# EAGLE design PSU (EAGLE 7.3.0)
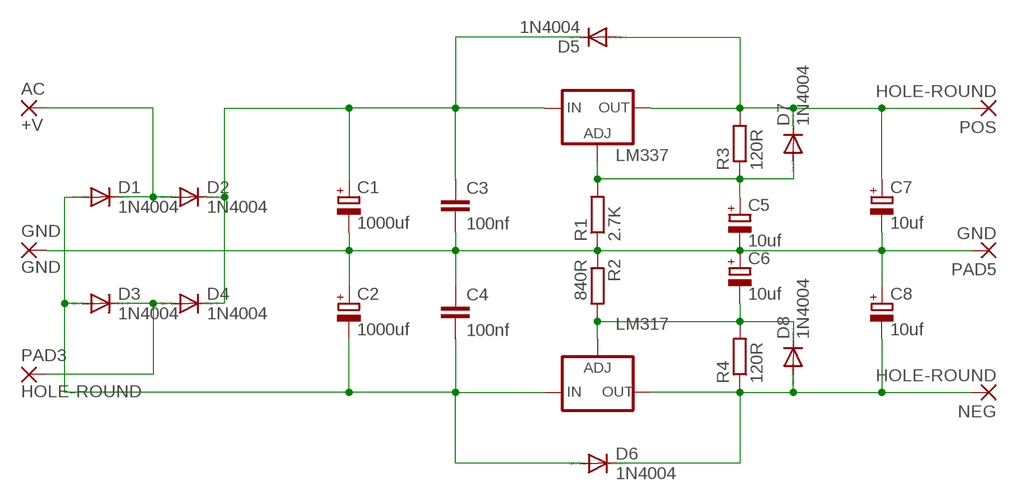
[diagram p0: schematic, sheet 1]

## Parts
AC  +V  HOLE-ROUND  [HOLE-ROUND]
C1  1000uf  CPOL-EUE3.5-10  [E3,5-10]
C2  1000uf  CPOL-EUE3.5-10  [E3,5-10]
C3  100nf  C-EU025-025X050  [C025-025X050]
C4  100nf  C-EU025-025X050  [C025-025X050]
C5  10uf  CPOL-EUE2.5-5  [E2,5-5]
C6  10uf  CPOL-EUE2.5-5  [E2,5-5]
C7  10uf  CPOL-EUE2.5-5  [E2,5-5]
C8  10uf  CPOL-EUE2.5-5  [E2,5-5]
D1  1N4004  [DO41-10]
D2  1N4004  [DO41-10]
D3  1N4004  [DO41-10]
D4  1N4004  [DO41-10]
D5  1N4004  [DO41-10]
D6  1N4004  [DO41-10]
D7  1N4004  [DO41-10]
D8  1N4004  [DO41-10]
GND  GND  HOLE-SQUARE  [HOLE-SQUARE]
LM317  LM337TS  [337TS]
LM337  LM317TS  [317TS]
NEG  HOLE-ROUND  [HOLE-ROUND]
PAD3  HOLE-ROUND  [HOLE-ROUND]
PAD5  GND  HOLE-SQUARE  [HOLE-SQUARE]
POS  HOLE-ROUND  [HOLE-ROUND]
R1  2.7K  R-EU_0204/7  [0204/7]
R2  840R  R-EU_0204/7  [0204/7]
R3  120R  R-EU_0204/7  [0204/7]
R4  120R  R-EU_0204/7  [0204/7]

## Nets
GND: C1.- C2.+ C3.2 C4.1 C5.- C6.+ C7.- C8.+ GND.1(P) PAD5.1(P) R1.1 R2.1
N$1: AC.1(P) D1.C D2.A
N$2: D3.C D4.A PAD3.1(P)
N$3: C6.- D8.C LM317.1(ADJ) R2.2 R4.2
N$4: C5.+ D7.A LM337.1(ADJ) R1.2 R3.1
N$5: C8.- D6.C D8.A LM317.3(OUT) NEG.1(P) R4.1
N$6: C1.+ C3.1 D2.C D4.C D5.C LM337.3(IN)
N$7: C7.+ D5.A D7.C LM337.2(OUT) POS.1(P) R3.2
N$9: C2.- C4.2 D1.A D3.A D6.A LM317.2(IN)

## Library data of the parts
AC NEG PAD3 POS = wirepad:HOLE-ROUND
C1 C2 C5-C8 = rcl:CPOL-EU: POLARIZED CAPACITOR, European symbol
C3 C4 = resistor:C-EU: CAPACITOR, European symbol
D1-D8 = diode:1N4004: DIODE general purpose rectifier, 1 A
GND PAD5 = wirepad:HOLE-SQUARE
LM317 = v-reg:LM337TS: VOLTAGE REGULATOR
LM337 = v-reg:LM317TS: VOLTAGE REGULATOR
R1-R4 = resistor:R-EU_: RESISTOR, European symbol

## Board
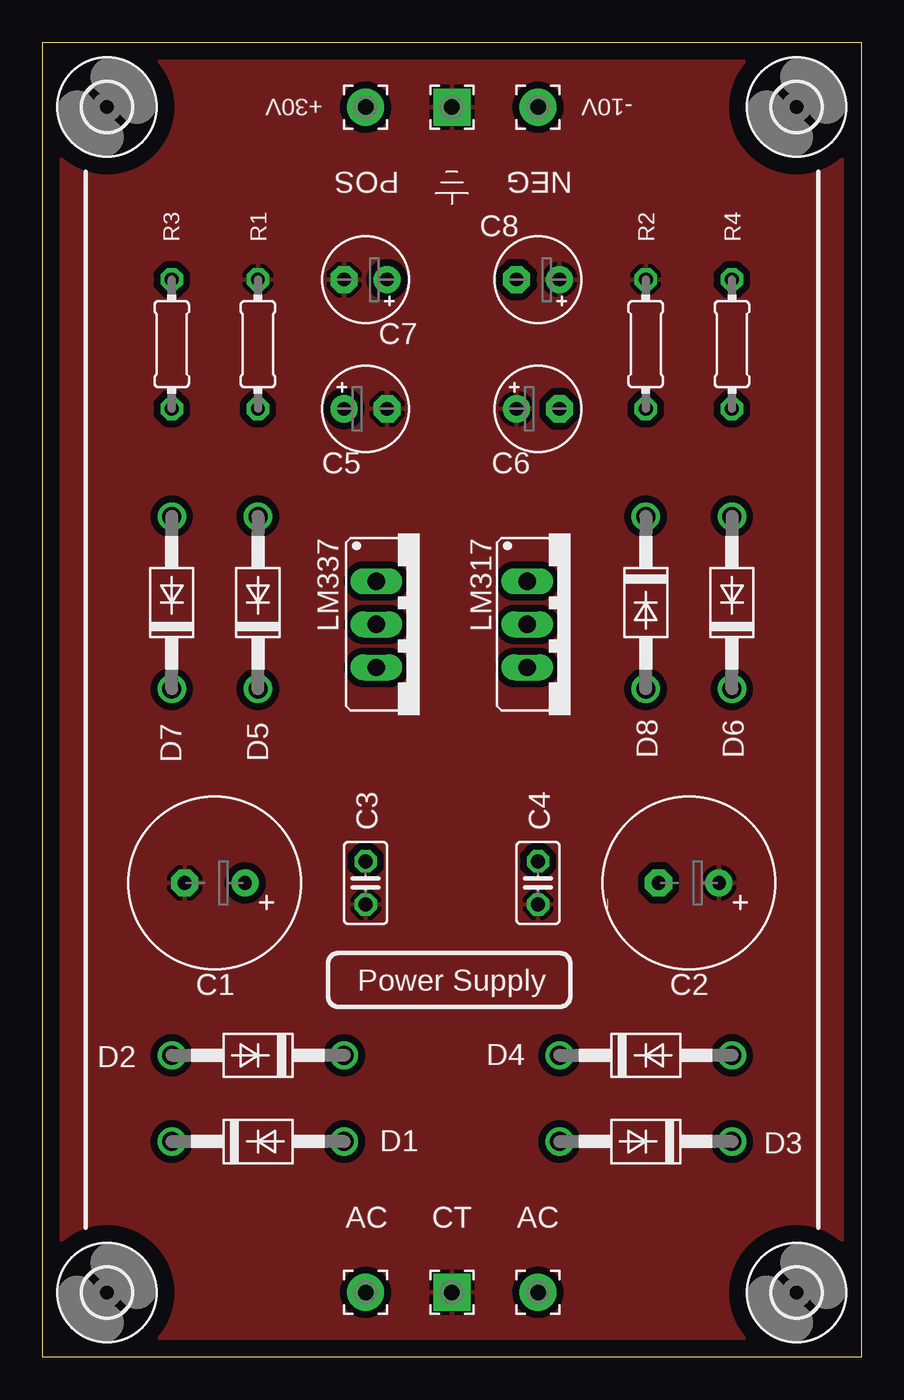
[diagram p1: board, top side]
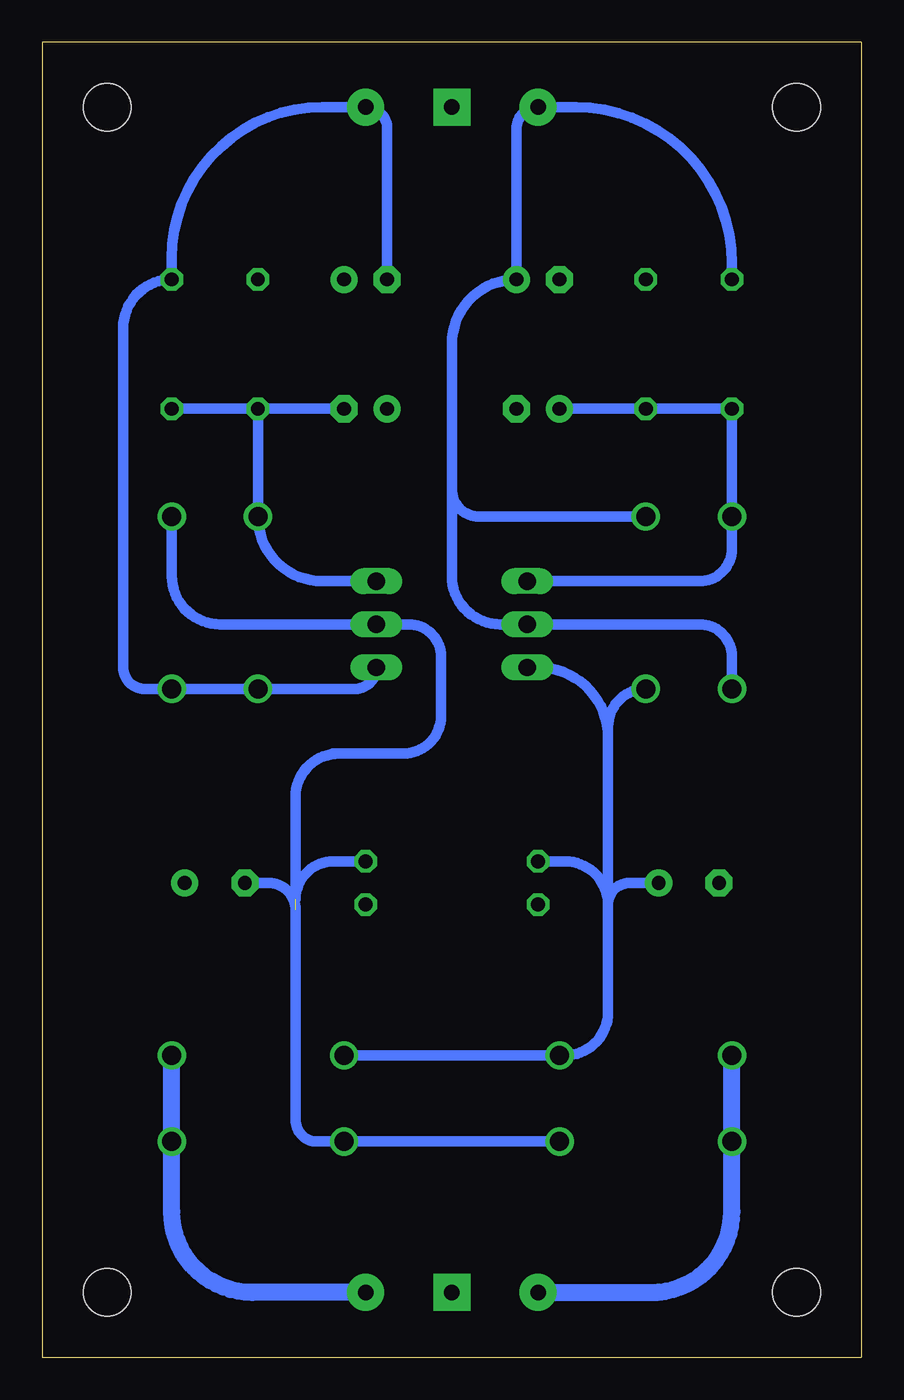
[diagram p2: board, bottom side, seen from below]

Size 48.26 x 77.47 mm. Coordinates in mm from the lower left corner, seen from the top.
Outline: 0,77.47 48.26,77.47 48.26,0 0,0 0,77.47
Copper layers (1*16): Top 0.035mm / dielectric 1.5mm / Bottom 0.035mm
Design rules "default": minimum track width 10mil, minimum drill 24mil, track to track 8mil, track to pad 8mil, pad to pad 8mil, via to via 8mil, smd to smd 8mil, copper to edge 40mil, drill to drill 8mil, minimum pad ring 10mil, minimum via ring 8mil, stop-mask expansion 4mil, vias tented up to drill 0mil, thermal gap 10mil

### Footprints (pad centres in the part's own frame; a part is rotated, then mirrored left to right if it is on the bottom)
HOLE-ROUND = drill 0.914 pad 2.184: 1 0,0
E3,5-10 = drill 0.813 pad 1.6: + -1.778,0 | drill 0.813 pad 1.6 octagon: - 1.778,0
C025-025X050 = drill 0.813 octagon: 1 -1.27,0; 2 1.27,0
E2,5-5 = drill 0.813 pad 1.6: + -1.27,0 | drill 0.813 pad 1.6 octagon: - 1.27,0
DO41-10 = drill 1.118: A 5.08,0; C -5.08,0
HOLE-SQUARE = drill 0.914 pad 2.184 square: 1 0,0
337TS = drill 1.016 long: 1 -2.54,-2.54; 2 0,-2.54; 3 2.54,-2.54
317TS = drill 1.016 long: 1 -2.54,-2.54; 2 0,-2.54; 3 2.54,-2.54
0204/7 = drill 0.813 octagon: 1 -3.81,0; 2 3.81,0
2,8 = hole 2.8: 0,0

### Placement (x,y rotation side)
AC  19.05,3.81 0 top
C1  10.16,27.94 180 top
C2  38.1,27.94 180 top
C3  19.05,27.94 270 top
C4  29.21,27.94 90 top
C5  19.05,55.88 0 top
C6  29.21,55.88 0 top
C7  19.05,63.5 180 top
C8  29.21,63.5 180 top
D1  12.7,12.7 0 top
D2  12.7,17.78 180 top
D3  35.56,12.7 180 top
D4  35.56,17.78 0 top
D5  12.7,44.45 90 top
D6  40.64,44.45 90 top
D7  7.62,44.45 90 top
D8  35.56,44.45 270 top
GND  24.13,3.81 0 top
LM317  31.11,43.18 270 top
LM337  22.23,43.18 270 top
NEG  29.21,73.66 0 top
PAD3  29.21,3.81 0 top
PAD5  24.13,73.66 0 top
POS  19.05,73.66 0 top
R1  12.7,59.69 270 top
R2  35.56,59.69 270 top
R3  7.62,59.69 90 top
R4  40.64,59.69 270 top
U$1  [2,8]  44.45,73.66 0 top
U$2  [2,8]  3.81,73.66 0 top
U$3  [2,8]  44.45,3.81 0 top
U$4  [2,8]  3.81,3.81 0 top

### Tracks (layer width: path | path; a pad name or v marks a point on that pad's centre or on a via)
GND
  pour Top (isolate 0.406): 0,82.55 48.26,82.55 48.26,0 0,0
N$1
  Bottom 1.016: AC.1 12.38,3.81 arc-90 7.62,8.57 D1.C D2.A
N$2
  Bottom 1.016: PAD3.1 35.88,3.81 arc90 40.64,8.57 D3.C D4.A
N$3
  Bottom 0.61: R4.2 R2.2 | C6.- R2.2 | R2.2 D8.C arc-90 31.75,45.72 LM317.1
N$4
  Bottom 0.61: C5.+ R1.2 R3.1 D7.A 7.62,47.62 arc90 9.53,45.72 LM337.1
N$5
  Bottom 0.61: LM317.3 arc90 29.84,39.37 D8.A D6.C 42.23,39.37 arc90 43.5,40.64 43.5,60.64 arc90 R4.1 40.64,64.77 arc90 31.75,73.66 NEG.1 arc90 27.94,72.39 C8.-
N$6
  Bottom 0.61: D4.C D2.C 17.46,17.78 arc-90 14.92,20.32 14.92,26.67 | 14.92,36.51 14.92,37.15 arc90 D5.C | LM337.3 19.05,40.64 arc90 14.92,36.51 | 14.92,26.67 arc90 13.65,27.94 C1.+ | 14.92,36.51 14.92,26.67 | 14.92,26.67 arc-90 17.46,29.21 C3.1
N$7
  Bottom 0.61: 24.13,51.12 24.13,59.69 arc90 C7.+ 20.32,72.39 arc90 POS.1 16.83,73.66 arc90 7.62,64.45 R3.2 | D5.A 22.54,49.53 arc90 24.13,51.12 | 24.13,51.12 24.13,46.04 arc-90 21.27,43.18 LM337.2 9.53,43.18 arc90 7.62,41.27 D7.C
N$9  (1 unrouted)
  Bottom 0.61: D1.A D3.A 32.07,12.7 arc90 33.34,13.97 33.34,26.35 arc-90 34.92,27.94 C2.- | 30.8,35.56 31.11,35.56 | C4.2 31.11,29.21 arc-90 33.34,26.99 33.34,33.02 arc90 30.8,35.56 | 30.8,35.56 26.99,35.56 arc-90 24.77,37.78 24.77,41.27 arc-90 26.67,43.18 LM317.2 37.78,43.18 arc90 40.64,46.04 D6.A

### Text on the board
tPlace: +30V | -10V | Power Supply | CT | AC